# EAGLE design trinketm0fader_60mm (EAGLE 9.4.2)
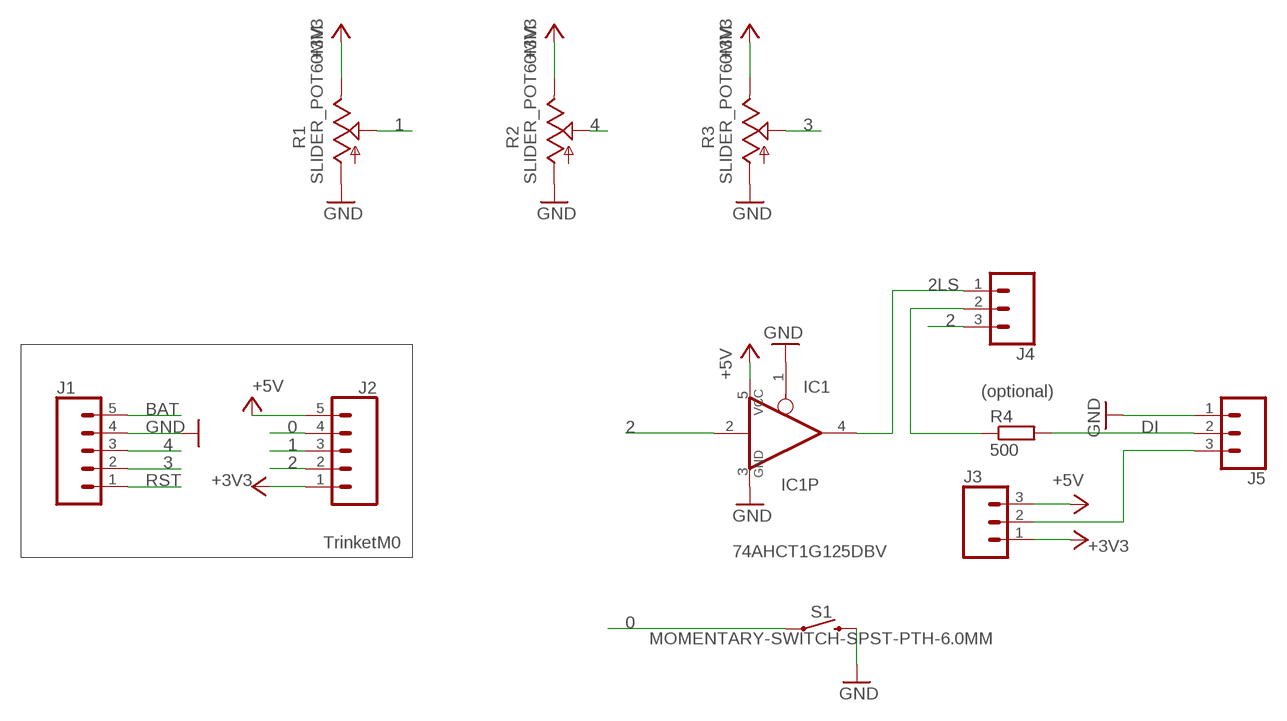
[diagram p0: schematic, sheet 1]

## Parts
IC1  74AHCT1G125DBV  [SOT23-5]
J1  CONN_05  [1X05]
J2  CONN_05  [1X05]
J3  CONN_03  [1X03]
J4  CONN_03  [1X03]
J5  CONN_03  [1X03]
R1  SLIDER_POT60MM  [SLIDEPOT_60MM]
R2  SLIDER_POT60MM  [SLIDEPOT_60MM]
R3  SLIDER_POT60MM  [SLIDEPOT_60MM]
R4  500  R-EU_R0603  [R0603]
S1  MOMENTARY-SWITCH-SPST-PTH-6.0MM  [TACTILE_SWITCH_PTH_6.0MM]

## Nets
0: J2.4 S1.1
1: J2.3 R1.W
2: IC1.2(I) J2.2 J4.3
2LS: IC1.4(O) J4.1
3: J1.2 R3.W
4: J1.3 R2.W
+3V3: J2.1 J3.1 R1.V R2.V R3.V
+5V: IC1.5(VCC) J2.5 J3.3
BAT: J1.5
DI: J5.2 R4.2
GND: IC1.1(OE) IC1.3(GND) J1.4 J5.1 R1.G R2.G R3.G S1.3
N$1: J3.2 J5.3
N$3: J4.2 R4.1
RST: J1.1

## Notes on the sheet
- (optional)
- TrinketM0

## Library data of the parts
IC1 = 74xx-little-us:74*1G125: Single Bus Buffer Gate with 3-State Output
J1 J2 = SparkFun-Connectors:CONN_05: Multi connection point. Often used as Generic Header-pin footprint for 0.1 inch spaced/style header connections On any of the 0.1 inch spaced packages, you can populate with these: Break Away Headers - Straight <https://www.sparkfun.com/products/116> (PRT-00116) Break Away Male Headers - Right Angle <https://www.sparkfun.com/products/553> (PRT-00553) Female Headers <https://www.sparkfun.com/products/115> (PRT-00115) Break Away Headers - Machine Pin <https://www.sparkfun.com/products/117> (PRT-00117) Break Away Female Headers - Swiss Machine Pin <https://www.sparkfun.com/products/743> (PRT-00743) For SCREWTERMINALS and SPRING TERMINALS visit here: Screw Terimnals on SparkFun.com <https://www.sparkfun.com/search/results?term=Screw+Terminals> (5mm/3.5mm/2.54mm spacing) This device is also useful as a general connection point to wire up your design to another part of your project. Our various solder wires solder well into these plated through hole pads. Hook-Up Wire - Assortment (Stranded, 22 AWG) <https://www.sparkfun.com/products/11375> (PRT-11375) Hook-Up Wire - Assortment (Solid Core, 22 AWG) <https://www.sparkfun.com/products/11367> (PRT-11367) View the entire wire category on our website here <https://www.sparkfun.com/categories/141> Special notes: Molex polarized connector foot print use with SKU : PRT-08231 with associated crimp pins and housings. 1MM SMD Version SKU: PRT-10208
J3-J5 = SparkFun-Connectors:CONN_03: Multi connection point. Often used as Generic Header-pin footprint for 0.1 inch spaced/style header connections On any of the 0.1 inch spaced packages, you can populate with these: Break Away Headers - Straight <https://www.sparkfun.com/products/116> (PRT-00116) Break Away Male Headers - Right Angle <https://www.sparkfun.com/products/553> (PRT-00553) Female Headers <https://www.sparkfun.com/products/115> (PRT-00115) Break Away Headers - Machine Pin <https://www.sparkfun.com/products/117> (PRT-00117) Break Away Female Headers - Swiss Machine Pin <https://www.sparkfun.com/products/743> (PRT-00743) Stackable Header - 3 Pin (Female, 0.1") <https://www.sparkfun.com/products/13875> (PRT-13875) For SCREWTERMINALS and SPRING TERMINALS visit here: Screw Terimnals on SparkFun.com <https://www.sparkfun.com/search/results?term=Screw+Terminals> (5mm/3.5mm/2.54mm spacing) This device is also useful as a general connection point to wire up your design to another part of your project. Our various solder wires solder well into these plated through hole pads. Hook-Up Wire - Assortment (Stranded, 22 AWG) <https://www.sparkfun.com/products/11375> (PRT-11375) Hook-Up Wire - Assortment (Solid Core, 22 AWG) <https://www.sparkfun.com/products/11367> (PRT-11367) View the entire wire category on our website here <https://www.sparkfun.com/categories/141> Special notes: Molex polarized connector foot print use with SKU : PRT-08232 with associated crimp pins and housings.
R1-R3 = todstuff:SLIDER_POT
R4 = rcl:R-EU_: RESISTOR, European symbol; SPICEPREFIX: R
S1 = SparkFun-Switches:MOMENTARY-SWITCH-SPST: Momentary Switch (Pushbutton) - SPST Normally-open (NO) SPST momentary switches (buttons, pushbuttons). Variants PTH-12MM - 12mm square, through-hole Momentary Pushbutton Switch - 12mm Square <https://www.sparkfun.com/products/9190> (COM-09190) PTH-6.0MM, PTH-6.0MM-KIT - 6.0mm square, through-hole Mini Pushbutton Switch <https://www.sparkfun.com/products/97> (COM-00097) KIT package intended for soldering kit's - only one side of pads' copper is exposed. PTH-RIGHT-ANGLE-KIT - Right-angle, through-hole Right Angle Tactile Button <https://www.sparkfun.com/products/10791> - Used on SparkFun BigTime Watch Kit <https://www.sparkfun.com/products/11734> SMD-12MM - 12mm square, surface-mount Tactile Button - SMD (12mm) <https://www.sparkfun.com/products/12993> (COM-12993) Used on SparkFun PicoBoard <https://www.sparkfun.com/products/11888> SMD-4.5MM - 4.5mm Square Trackball Switch Used on SparkFun Blackberry Trackballer Breakout <https://www.sparkfun.com/products/13169> SMD-4.6MMX2.8MM - 4.60mm x 2.80mm, surface mount Used on SparkFun SAMD21 Mini Breakout <https://www.sparkfun.com/products/13664> SMD-5.2MM, SMD-5.2-REDUNDANT - 5.2mm square, surface-mount Mini Pushbutton Switch - SMD <https://www.sparkfun.com/products/8720> (COM-08720) Used on Arduino Pro Mini <https://www.sparkfun.com/products/11114> REDUNDANT package connects both switch circuits together SMD-6.0X3.5MM - 6.0 x 3.5mm, surface mount Momentary Reset Switch SMD <https://www.sparkfun.com/products/8229> (COM-08229) SMD-6.2MM-TALL - 6.2mm square, surface mount Tactile Button - SMD (6mm) <https://www.sparkfun.com/products/12992> Used on SparkFun Digital Sandbox <https://www.sparkfun.com/products/12651> SMD-RIGHT-ANGLE - Right-angle, surface mount Used on SparkFun Block for Intel® Edison - Arduino <https://www.sparkfun.com/products/13036>; PROD_ID: SWCH-08441; SF_SKU: COM-00097

## Board
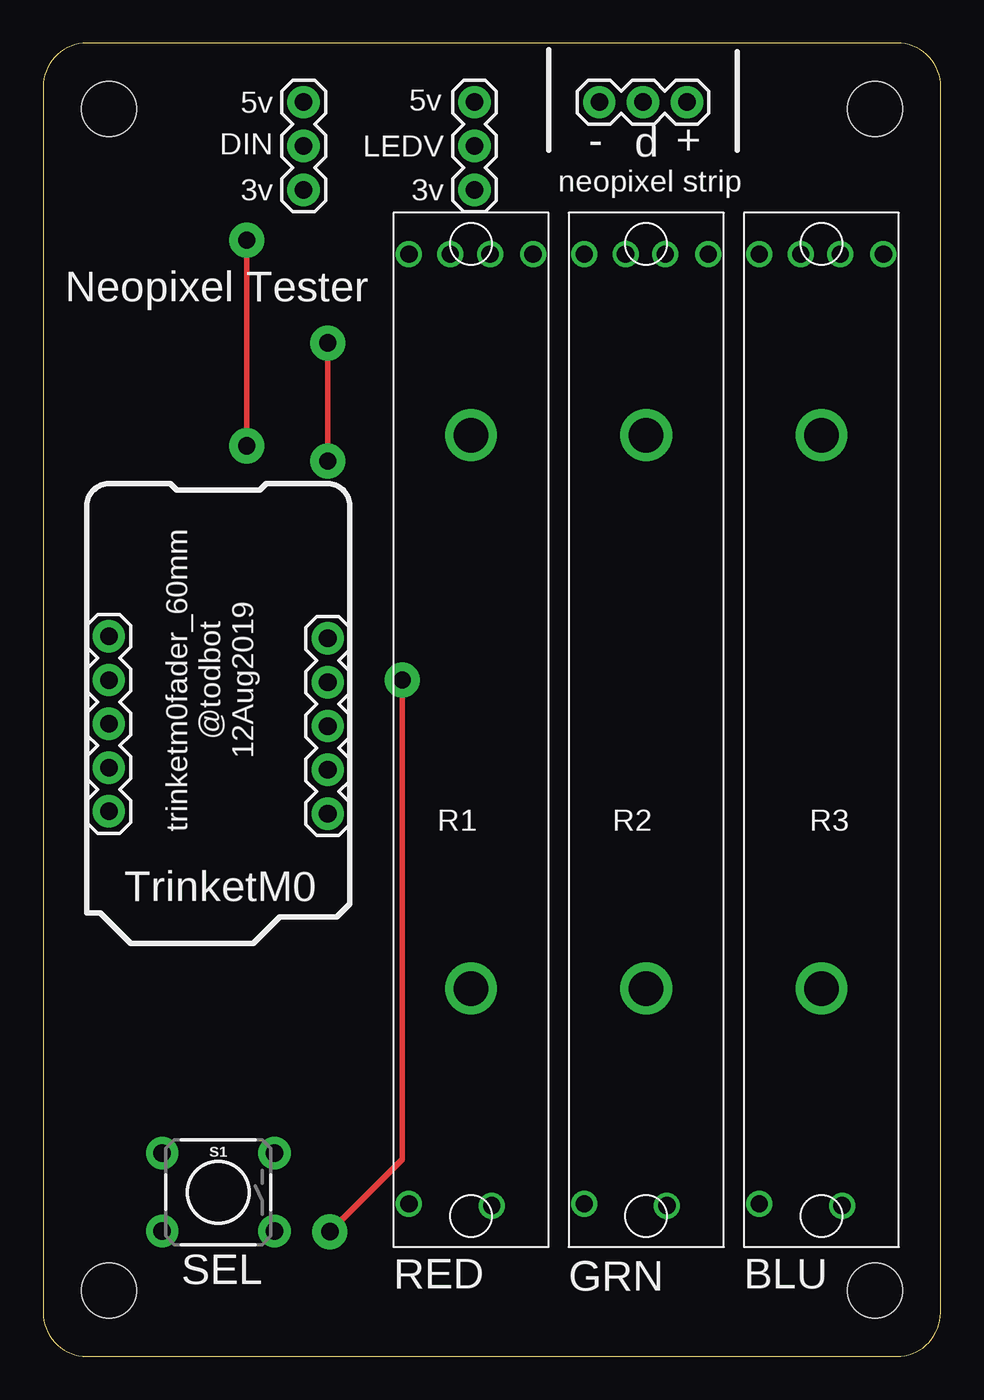
[diagram p1: board, top side]
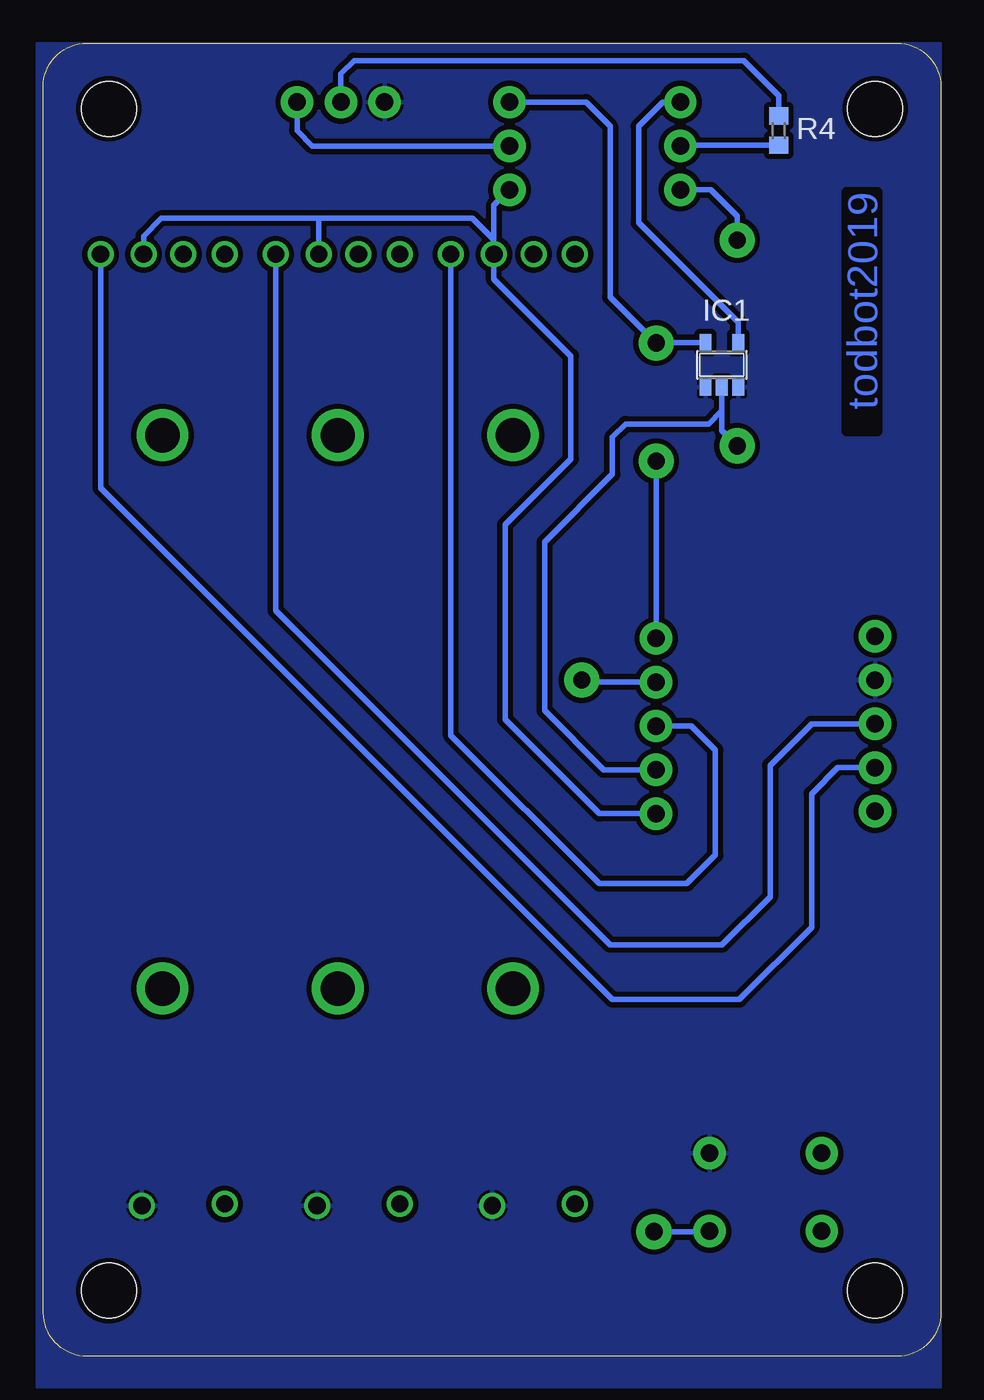
[diagram p2: board, bottom side, seen from below]

Size 52.07 x 76.2 mm. Coordinates in mm from the lower left corner, seen from the top.
Outline: 0,73.66 0,2.54 arc90 2.54,0 49.51,0 arc90 52.05,2.54 52.07,73.66 arc90 49.53,76.2 2.54,76.2 arc90 0,73.66
Copper layers (1*16): Top 0.035mm / dielectric 1.5mm / Bottom 0.035mm
Design rules "OthermillDRC_30_deg_v2": minimum track width 6mil, minimum drill 0.8mm, track to track 6mil, track to pad 6mil, pad to pad 6mil, via to via 6mil, smd to smd 0mil, copper to edge 0mil, drill to drill 6mil, minimum pad ring 10mil, minimum via ring 10mil, stop-mask expansion 1mil, vias tented up to drill 30mil, thermal gap 6mil
Holes 3.17 mm at 3.81,3.81 48.26,3.81 3.81,72.39 48.26,72.39

### Footprints (pad centres in the part's own frame; a part is rotated, then mirrored left to right if it is on the bottom)
SOT23-5 = smd 0.69 x 0.99: 1 -0.95,-1.29; 2 0,-1.29; 3 0.95,-1.29; 4 0.95,1.3; 5 -0.95,1.3
1X05 = drill 1.016 pad 1.88: 1 0,0; 2 2.54,0; 3 5.08,0; 4 7.62,0; 5 10.16,0
1X03 = drill 1.016 pad 1.88: 1 0,0; 2 2.54,0; 3 5.08,0
SLIDEPOT_60MM = drill 1: G 5.7,2.4; P$1 0.9,57.6; P$2 3.3,57.6; P$5 0.9,2.5; V 5.6,57.6; W 8.1,57.6 | drill 2: P$7 4.5,15; P$8 4.5,47.1
R0603 = smd 1 x 1.1: 1 -0.85,0; 2 0.85,0
TACTILE_SWITCH_PTH_6.0MM = drill 1.016 pad 1.88: 1 -3.251,2.261; 2 3.251,2.261; 3 -3.251,-2.261; 4 3.251,-2.261

### Placement (x,y rotation side)
IC1  12.7,57.53 0 bottom
J1  3.81,31.62 90 top
J2  16.51,31.5 90 top
J3  25.02,67.69 90 top
J4  15.11,72.77 270 top
J5  32.26,72.77 0 top
R1  20.32,6.35 0 top
R2  30.48,6.35 0 top
R3  40.64,6.35 0 top
R4  9.4,71.12 90 bottom
S1  10.16,9.53 180 top

### Tracks (layer width: path | path; a pad name or v marks a point on that pad's centre or on a via)
0  (via drill 1 pad 2.03)
  Top 0.305: v20.83,39.24 20.83,11.43 v16.64,7.24
  Bottom 0.305: v16.64,7.24 13.44,7.24 S1.1 | J2.4 20.7,39.12 v20.83,39.24
1
  Bottom 0.305: R1.W 28.42,36.04 19.81,27.43 14.73,27.43 13.08,29.08 13.08,35.18 14.48,36.58 J2.3
2  (via drill 1 pad 2.03)
  Top 0.305: v11.81,64.77 v11.81,52.83
  Bottom 0.305: IC1.2 12.7,54.86 | 12.7,54.86 12.7,53.72 v11.81,52.83 | J2.2 19.56,34.04 22.99,37.47 22.99,47.24 19.05,51.18 19.05,53.34 18.29,54.1 13.46,54.1 12.7,54.86 | J4.3 13.34,67.69 11.81,66.17 v11.81,64.77
2LS
  Bottom 0.305: IC1.4 11.75,60.01 17.53,65.79 17.53,71.37 16.13,72.77 J4.1
3
  Bottom 0.305: J1.2 5.97,34.16 7.49,32.64 7.49,24.89 11.68,20.7 19.05,20.7 48.74,50.39 R3.W
4
  Bottom 0.305: J1.3 7.49,36.7 9.91,34.29 9.91,26.67 12.7,23.88 19.18,23.88 38.58,43.28 R2.W
+3V3
  Bottom 0.305: R3.V 46.24,65.01 45.21,66.04 36.07,66.04 | R2.V 36.08,66.03 36.07,66.04 | J2.1 19.81,31.5 25.27,36.96 25.27,48.26 21.46,52.07 21.46,58.04 25.92,62.5 R1.V 25.92,64.39 25.92,64.78 | 25.92,64.78 27.18,66.04 36.07,66.04 | 25.53,67.69 J3.1 25.92,66.79 25.92,64.78
+5V  (via drill 1 pad 2.03)
  Top 0.305: v16.51,58.8 v16.51,51.94
  Bottom 0.305: v16.51,51.94 J2.5 | J3.3 20.57,72.77 19.18,71.37 19.18,61.47 v16.51,58.8 16.49,58.78 16.44,58.83 IC1.5
DI
  Bottom 0.305: R4.2 9.4,73.15 11.43,75.18 34.04,75.18 34.8,74.42 J5.2
GND
  pour Bottom (isolate 0.305): 0,76.2 52.45,76.2 52.45,-1.78 0,-1.78
N$1
  Bottom 0.305: J5.3 37.34,71.12 36.45,70.23 J3.2
N$3
  Bottom 0.305: J4.2 15.07,70.27 R4.1

### Text on the board
Bottom: todbot2019
tPlace: 5v | 5v | DIN | LEDV | - | d | + | neopixel strip | 3v | 3v | Neopixel Tester | trinketm0fader_60mm / @todbot / 12Aug2019 | TrinketM0 | SEL | RED | GRN | BLU
Measures: trinketm0fader_60mm / @todbot / 12Aug2019